# EAGLE schematic fanmonitor (EAGLE 6.4)
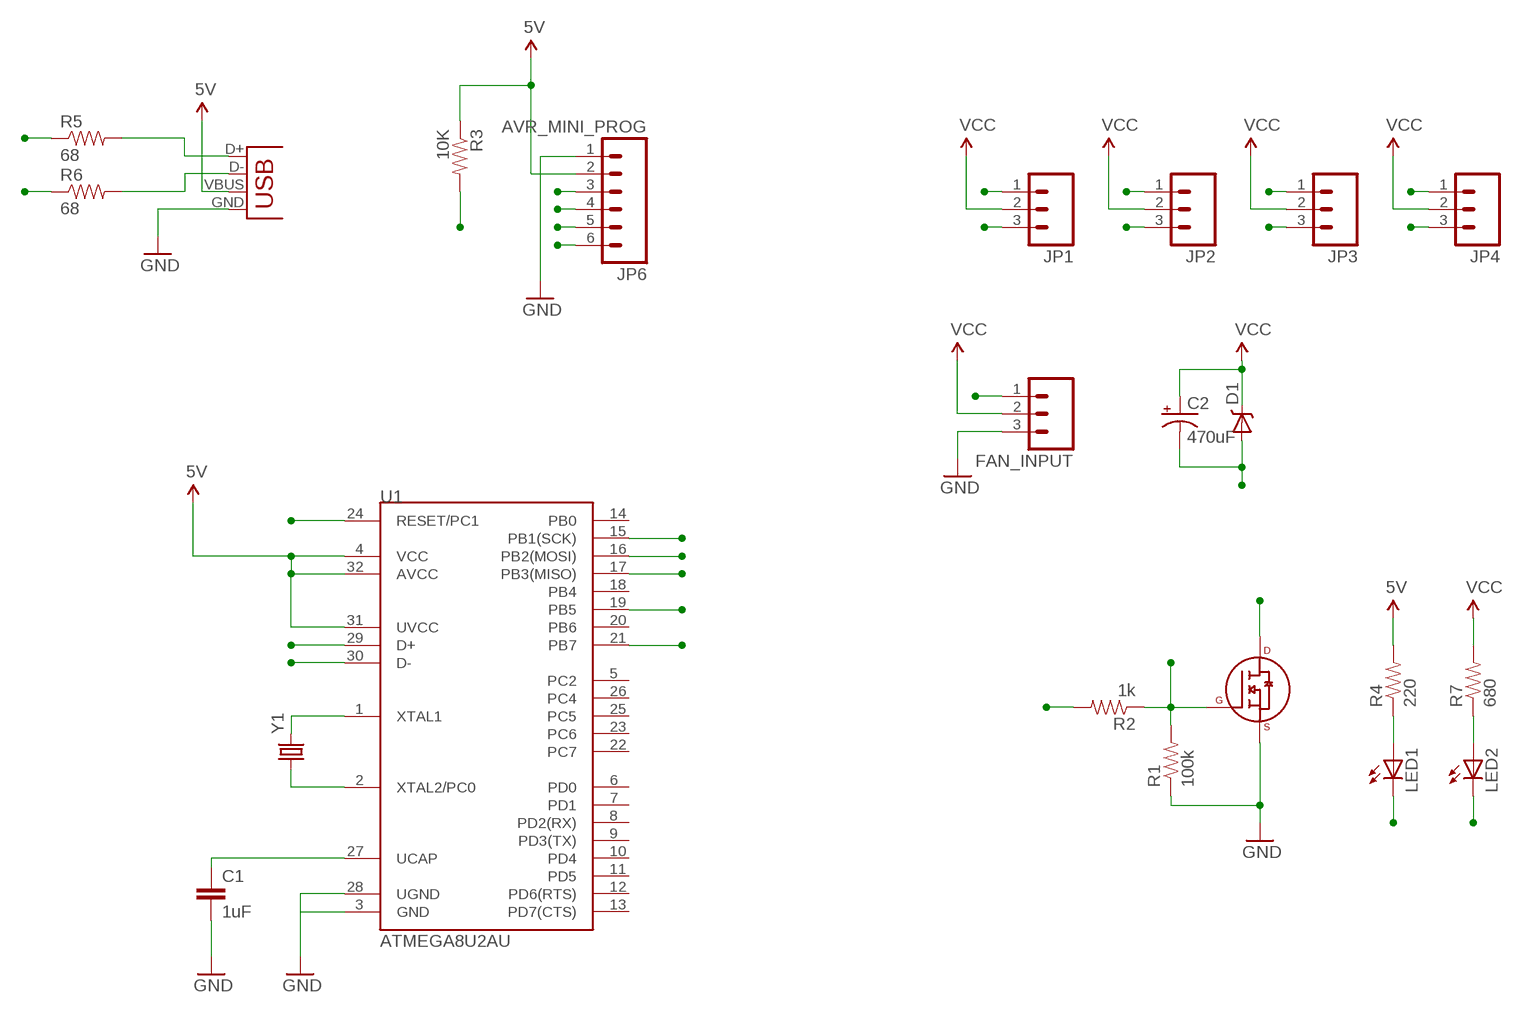
[diagram p0: schematic, sheet 1]

## Parts
C1  1uF  CAP0603-CAP  [0603-CAP]
C2  470uF  CAP_POLD  [PANASONIC_D]
D1  DIODE-SCHOTTKY_  [SMA-DIODE]
FAN_INPUT  M03PTH  [1X03]
JP1  M03PTH  [1X03]
JP2  M03PTH  [1X03]
JP3  M03PTH  [1X03]
JP4  M03PTH  [1X03]
JP6  AVR_MINI_PROG  M06SIP  [1X06]
LED1  LED0603  [LED-0603]
LED2  LED0603  [LED-0603]
R1  100k  RESISTOR0603-RES  [0603-RES]
R2  1k  RESISTOR0603-RES  [0603-RES]
R3  10K  RESISTOR0603-RES  [0603-RES]
R4  220  RESISTOR0603-RES  [0603-RES]
R5  68  RESISTOR0603-RES  [0603-RES]
R6  68  RESISTOR0603-RES  [0603-RES]
R7  680  RESISTOR0603-RES  [0603-RES]
U1  ATMEGA8U2AU  [TQFP32-08]
U$4  RFD14N05L  [TO-252AA]
X1  USBSMD  [USB-MINIB]
Y1  CRYSTAL5X3  [CRYSTAL-SMD-5X3]

## Nets
5V: JP6.2 R3.1 R4.2 U1.4(VCC) U1.31(UVCC) U1.32(AVCC) X1.VBUS
/RST: JP6.5 R3.2 U1.24(RESET/PC1)
D+: R5.1 U1.29(D+)
D-: R6.1 U1.30(D-)
GND: C1.2 FAN_INPUT.3 JP1.1 JP2.1 JP3.1 JP4.1 JP6.1 R1.1 U1.3(GND) U1.28(UGND) U$4.3(S) X1.GND
MISO: JP6.3 U1.17(PB3(MISO))
MOSI: JP6.6 U1.16(PB2(MOSI))
N$1: LED1.A R4.1
N$2: LED2.A R7.1
N$8: C1.1 U1.27(UCAP)
N$11: U1.1(XTAL1) Y1.3
N$12: U1.2(XTAL2/PC0) Y1.1
N$55: R5.2 X1.D+
N$56: R6.2 X1.D-
PWM: FAN_INPUT.1 R2.2 U1.21(PB7)
PWM_OUT: C2.- D1.A JP1.3 JP2.3 JP3.3 JP4.3 LED2.C U$4.4(D)
SCK: JP6.4 U1.15(PB1(SCK))
SPD: R1.2 R2.1 U$4.1(G)
STAT: LED1.C U1.19(PB5)
VCC: C2.+ D1.C FAN_INPUT.2 JP1.2 JP2.2 JP3.2 JP4.2 R7.2
Unconnected: U1.5(PC2) U1.6(PD0) U1.7(PD1) U1.8(PD2(RX)) U1.9(PD3(TX)) U1.10(PD4) U1.11(PD5) U1.12(PD6(RTS)) U1.13(PD7(CTS)) U1.14(PB0) U1.18(PB4) U1.20(PB6) U1.22(PC7) U1.23(PC6) U1.25(PC5) U1.26(PC4)

## Library data of the parts
C1 = SparkFun-Passives:CAP: Capacitor Standard 0603 ceramic capacitor, and 0.1" leaded capacitor.
C2 = SparkFun-Passives:CAP_POL: Capacitor Polarized These are standard SMD and PTH capacitors. Normally 10uF, 47uF, and 100uF in electrolytic and tantalum varieties. Always verify the external diameter of the through hole cap, it varies with capacity, voltage, and manufacturer. The EIA devices should be standard.
D1 = SparkFun-DiscreteSemi:DIODE-SCHOTTKY: Commonly MBRA140.
FAN_INPUT JP1-JP4 = SparkFun-Connectors:M03: Header 3 Standard 3-pin 0.1" header. Use with straight break away headers (SKU : PRT-00116), right angle break away headers (PRT-00553), swiss pins (PRT-00743), machine pins (PRT-00117), and female headers (PRT-00115). Molex polarized connector foot print use with SKU : PRT-08232 with associated crimp pins and housings.
JP6 = SparkFun-Connectors:M06: Header 6 Standard 6-pin 0.1" header. Use with straight break away headers (SKU : PRT-00116), right angle break away headers (PRT-00553), swiss pins (PRT-00743), machine pins (PRT-00117), and female headers (PRT-00115). Molex polarized connector foot print use with SKU : PRT-08094 with associated crimp pins and housings. NOTES ON THE VARIANTS LOCK and LOCK_LONGPADS... This footprint was designed to help hold the alignment of a through-hole component (i.e. 6-pin header) while soldering it into place. You may notice that each hole has been shifted either up or down by 0.005 of an inch from it's more standard position (which is a perfectly straight line). This slight alteration caused the pins (the squares in the middle) to touch the edges of the holes. Because they are alternating, it causes a "brace" to hold the component in place. 0.005 has proven to be the perfect amount of "off-center" position when using our standard breakaway headers. Although looks a little odd when you look at the bare footprint, once you have a header in there, the alteration is very hard to notice. Also, if you push a header all the way into place, it is covered up entirely on the bottom side. This idea of altering the position of holes to aid alignment will be further integrated into the Sparkfun Library for other footprints. It can help hold any component with 3 or more connection pins.
LED1 LED2 = SparkFun-LED:LED: LEDs Standard schematic elements and footprints for 5mm, 3mm, 1206, and 0603 sized LEDs. 5mm - Spark Fun Electronics SKU : COM-00529 (and others)
R1-R7 = SparkFun-Passives:RESISTOR: Resistor Basic schematic elements and footprints for 0603, 1206, and PTH resistors.
U1 = SparkFun-DigitalIC:ATMEGA8U2: Atmel 32-pin 8-bit Microcontroller with 8/16/32K Bystes of ISP Flash and USB Controller. ATmega8U2, ATmega16U2, and ATmega32U2
U$4 = Synapseware:RFD14N05L: 14A, 50V, 0.100 Ohm, Logic Level, N-Channel Power MOSFETs
X1 = SparkFun-Connectors:USB: USB Connectors USB-B-PTH is fully proven SKU : PRT-00139 USB-miniB is fully proven SKU : PRT-00587 USB-A-PCB is untested. USB-A-H is throughly reviewed, but untested. Spark Fun Electronics SKU : PRT-00437 USB-B-SMT is throughly reviewed, but untested. Needs silkscreen touching up. USB-A-S has not been used/tested USB-MB-H has not been used/tested
Y1 = SparkFun-FreqCtrl:CRYSTAL: Various standard crystals. Proven footprints. Spark Fun Electronics SKU : COM-00534